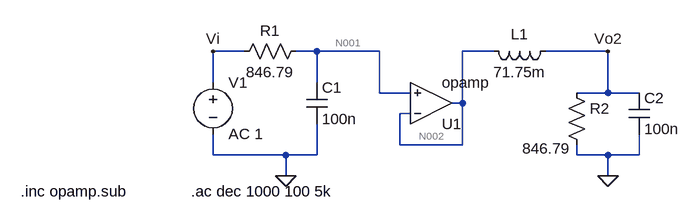
[diagram p0: schematic TS3_DESNORMALIZADO.asc]
TS3_DESNORMALIZADO.asc, the LTspice schematic file:
Version 4
SHEET 1 880 680
WIRE 0 80 -48 80
WIRE 112 80 80 80
WIRE 208 80 112 80
WIRE 384 80 336 80
WIRE 560 80 464 80
WIRE -48 128 -48 80
WIRE 112 128 112 80
WIRE 208 144 208 80
WIRE 256 144 208 144
WIRE 560 144 560 80
WIRE 560 144 512 144
WIRE 608 144 560 144
WIRE 336 160 336 80
WIRE 336 160 320 160
WIRE 256 176 240 176
WIRE 240 224 240 176
WIRE 336 224 336 160
WIRE 336 224 240 224
WIRE -48 240 -48 208
WIRE 64 240 -48 240
WIRE 112 240 112 192
WIRE 112 240 64 240
WIRE 512 240 512 224
WIRE 560 240 512 240
WIRE 608 240 608 208
WIRE 608 240 560 240
WIRE 64 272 64 240
WIRE 560 272 560 240
FLAG -48 80 Vi
FLAG 64 272 0
FLAG 560 272 0
FLAG 560 80 Vo2
SYMBOL res 96 64 R90
WINDOW 0 0 56 VBottom 2
WINDOW 3 32 56 VTop 2
SYMATTR InstName R1
SYMATTR Value 846.79
SYMBOL cap 96 128 R0
SYMATTR InstName C1
SYMATTR Value 100n
SYMBOL voltage -48 112 R0
WINDOW 123 24 95 Left 2
WINDOW 39 0 0 Left 2
SYMATTR InstName V1
SYMATTR Value ""
SYMATTR Value2 AC 1
SYMBOL ind 480 64 R90
WINDOW 0 5 56 VBottom 2
WINDOW 3 32 56 VTop 2
SYMATTR InstName L1
SYMATTR Value 71.75m
SYMBOL res 496 128 R0
WINDOW 3 -68 102 Left 2
SYMATTR InstName R2
SYMATTR Value 846.79
SYMBOL cap 592 144 R0
SYMATTR InstName C2
SYMATTR Value 100n
SYMBOL Opamps\\opamp 288 224 M180
SYMATTR InstName U1
TEXT -82 296 Left 2 !.ac dec 1000 100 5k
TEXT -344 296 Left 2 !.inc opamp.sub

The netlist it stands for:
* TS3_DESNORMALIZADO.asc
R1 N001 Vi 846.79
C1 N001 0 100n
V1 Vi 0 AC 1
L1 Vo2 N002 71.75m
R2 Vo2 0 846.79
C2 Vo2 0 100n
XU1 N002 N001 N002 opamp Aol=100K GBW=10Meg  ; pins invin noninvin out
.ac dec 1000 100 5k
.inc opamp.sub
.backanno
.end

* Results of the author's LTspice run, read from the files saved beside the schematic
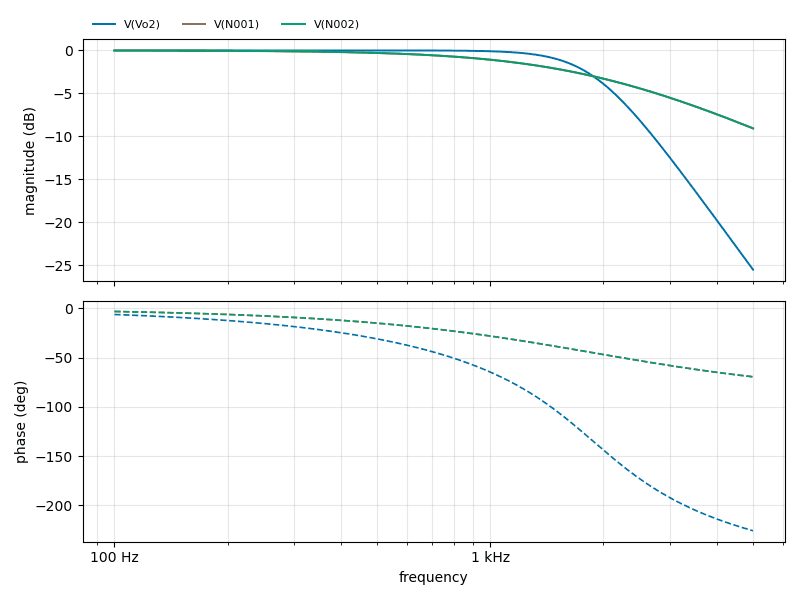
[diagram p1: AC Analysis of TS3_DESNORMALIZADO.asc, plotted from the saved traces]
* AC Analysis, 1 run:
*   V(Vo2): -0.00 dB at 100 Hz, -25.51 dB at 5 kHz, peak -0.00 dB at 100 Hz, 3 dB below the peak at 1.879 kHz
*   V(N001): -0.01 dB at 100 Hz, -9.07 dB at 5 kHz, peak -0.01 dB at 100 Hz, 3 dB below the peak at 1.885 kHz
*   V(N002): -0.01 dB at 100 Hz, -9.07 dB at 5 kHz, peak -0.01 dB at 100 Hz, 3 dB below the peak at 1.885 kHz